# Altium schematic sheet IO.SchDoc: IO
size A4; Engineer: Samer Kilani; DocumentNumber: 4; SheetNumber: 4; SheetTotal: 9
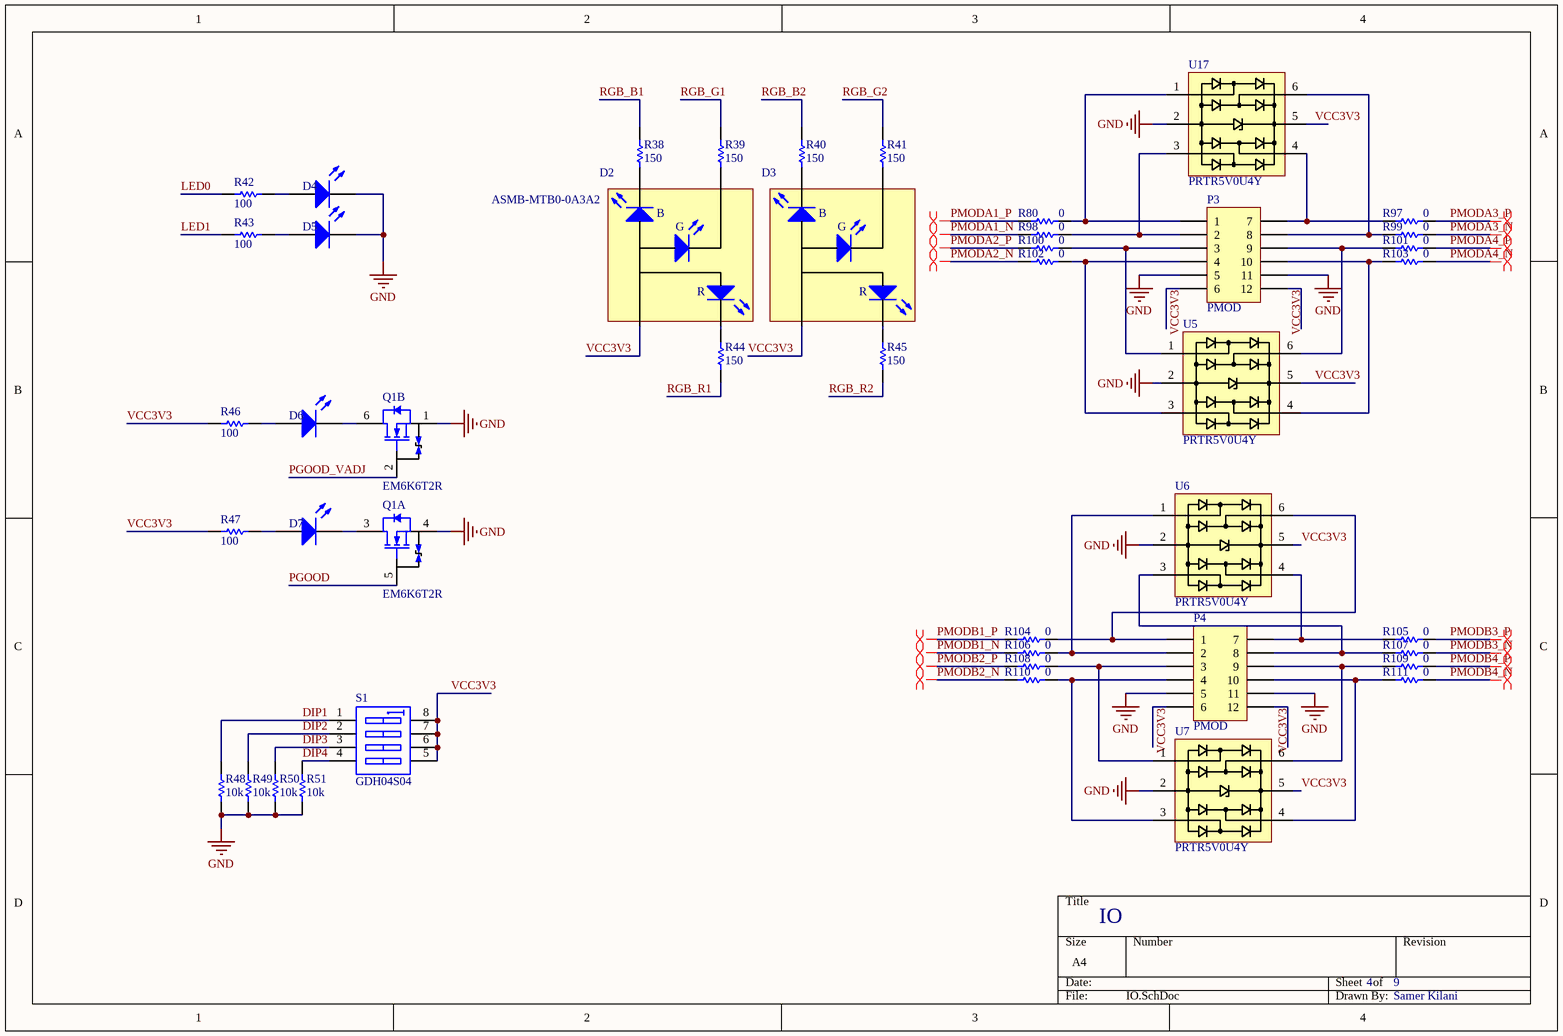
[diagram p0: IO.SchDoc]

## Parts
D2  ASMB-MTB0-0A3A2  [ASMB-MTB0-0A3A2]
D3  ASMB-MTB0-0A3A2  [ASMB-MTB0-0A3A2]  (value not drawn)
D4  KPT-1608EC  [KP-1608QBC-D]  (value not drawn)
D5  KPT-1608EC  [KP-1608QBC-D]  (value not drawn)
D6  KPT-1608EC  [KP-1608QBC-D]  (value not drawn)
D7  KPT-1608EC  [KP-1608QBC-D]  (value not drawn)
P3  PMOD  [PMOD_12]
P4  PMOD  [PMOD_12]
Q1  EM6K6T2R  [SOT-563]  (parts A,B of 2)
R38  value 150  [R0402]  (hidden comment: Res)
R39  value 150  [R0402]  (hidden comment: Res)
R40  value 150  [R0402]  (hidden comment: Res)
R41  value 150  [R0402]  (hidden comment: Res)
R42  value 100  [R0402]  (hidden comment: Res)
R43  value 100  [R0402]  (hidden comment: Res)
R44  value 150  [R0402]  (hidden comment: Res)
R45  value 150  [R0402]  (hidden comment: Res)
R46  value 100  [R0402]  (hidden comment: Res)
R47  value 100  [R0402]  (hidden comment: Res)
R48  value 10k  [R0402]  (hidden comment: Res)
R49  value 10k  [R0402]  (hidden comment: Res)
R50  value 10k  [R0402]  (hidden comment: Res)
R51  value 10k  [R0402]  (hidden comment: Res)
R80  value 0  [R0402]  (hidden comment: Res)
R97  value 0  [R0402]  (hidden comment: Res)
R98  value 0  [R0402]  (hidden comment: Res)
R99  value 0  [R0402]  (hidden comment: Res)
R100  value 0  [R0402]  (hidden comment: Res)
R101  value 0  [R0402]  (hidden comment: Res)
R102  value 0  [R0402]  (hidden comment: Res)
R103  value 0  [R0402]  (hidden comment: Res)
R104  value 0  [R0402]  (hidden comment: Res)
R105  value 0  [R0402]  (hidden comment: Res)
R106  value 0  [R0402]  (hidden comment: Res)
R107  value 0  [R0402]  (hidden comment: Res)
R108  value 0  [R0402]  (hidden comment: Res)
R109  value 0  [R0402]  (hidden comment: Res)
R110  value 0  [R0402]  (hidden comment: Res)
R111  value 0  [R0402]  (hidden comment: Res)
S1  GDH04S04  [DIP-SOP8]
U5  PRTR5V0U4Y  [SOT363]
U6  PRTR5V0U4Y  [SOT363]
U7  PRTR5V0U4Y  [SOT363]
U17  PRTR5V0U4Y  [SOT363]

## Nets
GND: D4.2(K) D5.2(K) P3.5 P3.11 P4.5 P4.11 Q1.1(S1) Q1.4(S1) R48.2 R49.2 R50.2 R51.2 U5.2 U6.2 U7.2 U17.2
DIP1: R48.1 S1.1(A1)
DIP2: R49.1 S1.2(A2)
DIP3: R50.1 S1.3(A3)
DIP4: R51.1 S1.4(A4)
LED0: R42.2
LED1: R43.2
PGOOD: Q1.5(G1)
PGOOD_VADJ: Q1.2(G1)
PMODA1_N: R98.1
PMODA1_P: R80.1
PMODA2_N: R102.1
PMODA2_P: R100.1
PMODA3_N: R99.2
PMODA3_P: R97.2
PMODA4_N: R103.2
PMODA4_P: R101.2
PMODB1_N: R106.1
PMODB1_P: R104.1
PMODB2_N: R110.1
PMODB2_P: R108.1
PMODB3_N: R107.2
PMODB3_P: R105.2
PMODB4_N: R111.2
PMODB4_P: R109.2
RGB_B1: R38.2
RGB_B2: R40.2
RGB_G1: R39.2
RGB_G2: R41.2
RGB_R1: R44.1
RGB_R2: R45.1
VCC3V3: D2.1(A) D3.1(A) P3.6 P3.12 P4.6 P4.12 R46.2 R47.2 S1.5(B4) S1.6(B3) S1.7(B2) S1.8(B1) U5.5 U6.5 U7.5 U17.5
NetD2_2: D2.2(B) R38.1
NetD2_3: D2.3(G) R39.1
NetD2_4: D2.4(R) R44.2
NetD3_2: D3.2(B) R40.1
NetD3_3: D3.3(G) R41.1
NetD3_4: D3.4(R) R45.2
NetD4_1: D4.1(A) R42.1
NetD5_1: D5.1(A) R43.1
NetD6_1: D6.1(A) R46.1
NetD6_2: D6.2(K) Q1.6(D1)
NetD7_1: D7.1(A) R47.1
NetD7_2: D7.2(K) Q1.3(D1)
NetP3_1: P3.1 R80.2 U17.1
NetP3_2: P3.2 R98.2 U17.3
NetP3_3: P3.3 R100.2 U5.1
NetP3_4: P3.4 R102.2 U5.3
NetP3_7: P3.7 R97.1 U17.4
NetP3_8: P3.8 R99.1 U17.6
NetP3_9: P3.9 R101.1 U5.6
NetP3_10: P3.10 R103.1 U5.4
NetP4_1: P4.1 R104.2 U6.6
NetP4_2: P4.2 R106.2 U6.1
NetP4_3: P4.3 R108.2 U7.1
NetP4_4: P4.4 R110.2 U7.3
NetP4_7: P4.7 R105.1 U6.4
NetP4_8: P4.8 R107.1 U6.3
NetP4_9: P4.9 R109.1 U7.6
NetP4_10: P4.10 R111.1 U7.4

## Layout directives
differential pair: PMODA1_N, PMODA1_P, PMODA2_N, PMODA2_P, PMODA3_N, PMODA3_P, PMODA4_N, PMODA4_P, PMODB1_N, PMODB1_P, PMODB2_N, PMODB2_P, PMODB3_N, PMODB3_P, PMODB4_N, PMODB4_P

## Library data of the parts
D2 D3 = LED_RGB: Typical INFRARED GaAs LED; Published: 8-Jun-2000; LatestRevisionDate: 08-Jul-2005; LatestRevisionNote: Mech Layer 1 removed.; PackageReference: LED-0; Publisher: Altium Limited; PackageDescription: LED; 2 Leads
D4-D7 = LED: Published: 8-Jun-2000; LatestRevisionDate: 08-Jul-2005; LatestRevisionNote: Mech Layer 1 removed.; PackageReference: LED-0; Publisher: Altium Limited; PackageDescription: LED; 2 Leads
P3 P4 = Header 6X2A: Header, 6-Pin, Dual row; LatestRevisionDate: 17-Jul-2002; LatestRevisionNote: Re-released for DXP Platform.; Publisher: Altium Limited
Q1 = EM6K6
R38-R51 R80 R97-R111 = Res: Resistor
S1 = SW DIP-4: DIP Switch, 4 Position, SPST; Published: 24-Mar-1999; LatestRevisionDate: 29-May-2009; LatestRevisionNote: IPC-7351 Footprint Added.; PackageVersion: Dec-2002; PackageReference: SO8; Publisher: Altium Limited; PackageDescription: 8-Pin Small Outline Integrated Circuit 1.27 mm Pitch; Code_JEDEC: MS-012-AA; Code_IPC: SOIC127P600-8